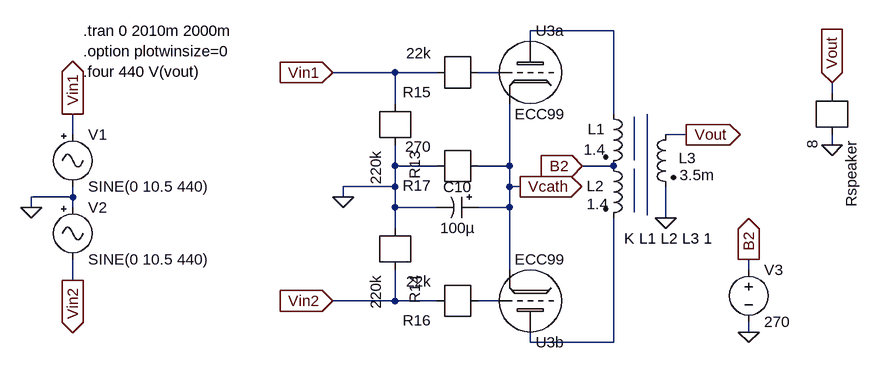
[diagram p0: schematic power.asc]
power.asc, the LTspice schematic file:
Version 4
SHEET 1 1096 680
WIRE 688 32 560 32
WIRE 560 48 560 32
WIRE 352 96 256 96
WIRE 416 96 352 96
WIRE 512 96 480 96
WIRE 1024 128 1024 112
WIRE 352 144 352 96
WIRE 688 160 688 32
WIRE -144 192 -144 160
WIRE 800 192 768 192
WIRE 1024 208 1024 192
WIRE 352 240 352 208
WIRE 416 240 352 240
WIRE 528 240 528 144
WIRE 528 240 480 240
WIRE 688 240 640 240
WIRE 352 272 352 240
WIRE 352 272 272 272
WIRE 528 272 528 240
WIRE 544 272 528 272
WIRE -144 288 -144 272
WIRE -144 288 -208 288
WIRE 272 288 272 272
WIRE -208 304 -208 288
WIRE -144 304 -144 288
WIRE 352 304 352 272
WIRE 416 304 352 304
WIRE 528 304 528 272
WIRE 528 304 480 304
WIRE 768 320 768 272
WIRE 352 336 352 304
WIRE 528 400 528 304
WIRE 896 400 896 384
WIRE -144 416 -144 384
WIRE 352 448 352 400
WIRE 352 448 256 448
WIRE 416 448 352 448
WIRE 512 448 480 448
WIRE 896 496 896 480
WIRE 560 512 560 496
WIRE 688 512 688 320
WIRE 688 512 560 512
FLAG -208 304 0
FLAG -144 160 Vin1
IOPIN -144 160 Out
FLAG -144 416 Vin2
IOPIN -144 416 Out
FLAG 256 96 Vin1
IOPIN 256 96 In
FLAG 256 448 Vin2
IOPIN 256 448 In
FLAG 272 288 0
FLAG 640 240 B2
IOPIN 640 240 In
FLAG 768 320 0
FLAG 800 192 Vout
IOPIN 800 192 Out
FLAG 896 496 0
FLAG 896 384 B2
IOPIN 896 384 Out
FLAG 1024 208 0
FLAG 1024 112 Vout
IOPIN 1024 112 In
FLAG 544 272 Vcath
IOPIN 544 272 Out
SYMBOL signal -144 176 R0
SYMATTR InstName V1
SYMATTR Value SINE(0 10.5 440)
SYMBOL signal -144 288 R0
SYMATTR InstName V2
SYMATTR Value SINE(0 10.5 440)
SYMBOL r 352 144 R90
SYMATTR InstName R13
SYMATTR Value 220k
SYMBOL r 352 336 R90
SYMATTR InstName R14
SYMATTR Value 220k
SYMBOL r 480 96 R180
SYMATTR InstName R15
SYMATTR Value 22k
SYMBOL r 480 240 R180
SYMATTR InstName R17
SYMATTR Value 270
SYMBOL r 480 448 R180
SYMATTR InstName R16
SYMATTR Value 22k
SYMBOL ECC99 560 96 R0
SYMATTR InstName U3a
SYMBOL ECC99 560 448 M180
SYMATTR InstName U3b
SYMBOL polcap 480 288 R90
WINDOW 0 0 32 VBottom 2
WINDOW 3 32 32 VTop 2
SYMATTR InstName C10
SYMATTR Value 100µ
SYMBOL ind2 672 144 R0
WINDOW 0 -24 39 Left 2
WINDOW 3 -30 71 Left 2
SYMATTR InstName L1
SYMATTR Value 1.4
SYMBOL ind2 672 224 R0
WINDOW 0 -25 47 Left 2
WINDOW 3 -25 75 Left 2
SYMATTR InstName L2
SYMATTR Value 1.4
SYMBOL ind2 784 176 M0
WINDOW 0 -31 52 Left 2
WINDOW 3 -60 78 Left 2
SYMATTR InstName L3
SYMATTR Value 3.5m
SYMBOL voltage 896 384 R0
SYMATTR InstName V3
SYMATTR Value 270
SYMBOL r 1024 128 R90
SYMATTR InstName Rspeaker
SYMATTR Value 8
TEXT 704 352 Left 2 !K L1 L2 L3 1
TEXT -128 32 Left 2 !.tran 0 2010m 2000m\n.option plotwinsize=0\n.four 440 V(vout)
LINE Normal 740 160 740 316
LINE Normal 720 164 720 232
LINE Normal 720 244 720 312

The netlist it stands for:
* power.asc
V1 Vin1 0 SINE(0 10.5 440)
V2 0 Vin2 SINE(0 10.5 440)
R13 0 Vin1 220k
R14 Vin2 0 220k
R15 Vin1 N002 22k
R17 0 Vcath 270
R16 Vin2 N003 22k
XU3a N001 N002 Vcath ECC99  ; pins Plate Grid Cathode
XU3b N004 N003 Vcath ECC99  ; pins Plate Grid Cathode
C10 Vcath 0 100µ
L1 N001 B2 1.4
L2 B2 N004 1.4
L3 Vout 0 3.5m
V3 B2 0 270
Rspeaker 0 Vout 8
K L1 L2 L3 1
.tran 0 2010m 2000m
.option plotwinsize=0
.four 440 V(vout)
.lib ECC99.sub
.backanno
.end